# Altium project Autonomous Terminal Board.PrjPcb
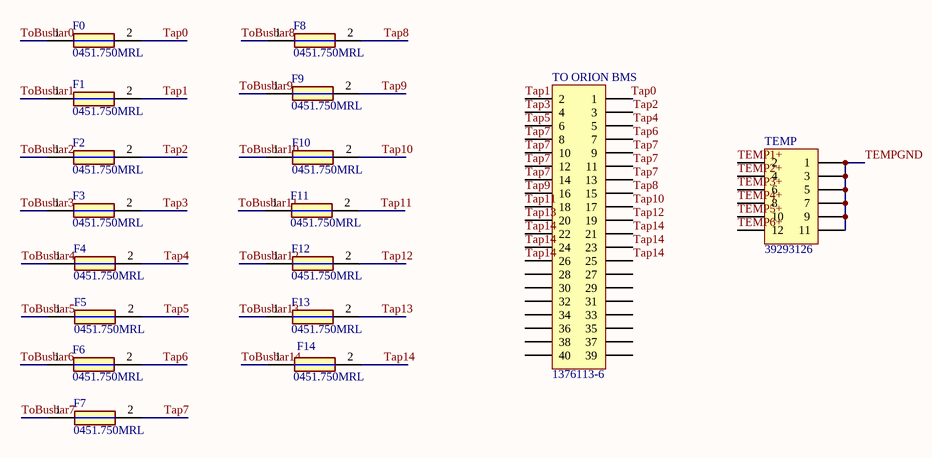
[diagram p0: Terminal Board Schematic.SchDoc]
1 sheet, 17 parts. Net scope: global (net labels, ports and power ports of the same name join across sheets).
Board files: Terminal_Board_PCB.PcbDoc, Terminal_Board_PCB V2.PcbDoc, Terminal_Board_PCB V3.PcbDoc, Terminal_Board_PCB V4.PcbDoc

## Sheet Terminal Board Schematic.SchDoc
size A3; SheetNumber: 1; SheetTotal: 1

### Parts
F0  0451.750MRL  [FUSC6127X269N]
F1  0451.750MRL  [FUSC6127X269N]
F2  0451.750MRL  [FUSC6127X269N]
F3  0451.750MRL  [FUSC6127X269N]
F4  0451.750MRL  [FUSC6127X269N]
F5  0451.750MRL  [FUSC6127X269N]
F6  0451.750MRL  [FUSC6127X269N]
F7  0451.750MRL  [FUSC6127X269N]
F8  0451.750MRL  [FUSC6127X269N]
F9  0451.750MRL  [FUSC6127X269N]
F10  0451.750MRL  [FUSC6127X269N]
F11  0451.750MRL  [FUSC6127X269N]
F12  0451.750MRL  [FUSC6127X269N]
F13  0451.750MRL  [FUSC6127X269N]
F14  0451.750MRL  [FUSC6127X269N]
TEMP  39293126  [39293126]
TO_ORION_BMS  1376113-6  [1376113-6]

### Nets
Tap0: F0.2 TO_ORION_BMS.1
Tap1: F1.2 TO_ORION_BMS.2
Tap2: F2.2 TO_ORION_BMS.3
Tap3: F3.2 TO_ORION_BMS.4
Tap4: F4.2 TO_ORION_BMS.5
Tap5: F5.2 TO_ORION_BMS.6
Tap6: F6.2 TO_ORION_BMS.7
Tap7: F7.2 TO_ORION_BMS.8 TO_ORION_BMS.9 TO_ORION_BMS.10 TO_ORION_BMS.11 TO_ORION_BMS.12 TO_ORION_BMS.13 TO_ORION_BMS.14
Tap8: F8.2 TO_ORION_BMS.15
Tap9: F9.2 TO_ORION_BMS.16
Tap10: F10.2 TO_ORION_BMS.17
Tap11: F11.2 TO_ORION_BMS.18
Tap12: F12.2 TO_ORION_BMS.19
Tap13: F13.2 TO_ORION_BMS.20
Tap14: F14.2 TO_ORION_BMS.21 TO_ORION_BMS.22 TO_ORION_BMS.23 TO_ORION_BMS.24 TO_ORION_BMS.25 TO_ORION_BMS.26
TEMP1+: TEMP.2
TEMP2+: TEMP.4
TEMP3+: TEMP.6
TEMP4+: TEMP.8
TEMP5+: TEMP.10
TEMP6+: TEMP.12
TEMPGND: TEMP.1 TEMP.3 TEMP.5 TEMP.7 TEMP.9 TEMP.11
ToBusbar0: F0.1
ToBusbar1: F1.1
ToBusbar2: F2.1
ToBusbar3: F3.1
ToBusbar4: F4.1
ToBusbar5: F5.1
ToBusbar6: F6.1
ToBusbar7: F7.1
ToBusbar8: F8.1
ToBusbar9: F9.1
ToBusbar10: F10.1
ToBusbar11: F11.1
ToBusbar12: F12.1
ToBusbar13: F13.1
ToBusbar14: F14.1

Not connected (* = marked no-connect by the designer): TO_ORION_BMS 27 28 29 30 31 32 33 34 35 36 37 38 39 40

### Notes on the sheet
- Section Leader Check:
- Date:
- Title:
- Revision
- Variant
- Project:
- Engineers:
- Sheet
- of

### Library data of the parts
F0-F14 = 0451.750MRL: Fuse Chip Very Fast Acting 0.75A 125V SMD Solder Pad 2410 Ceramic T/R; Manufacturer_Name: LITTELFUSE; Current Rating: 750mA; Resistance: 245mR; Fuse Type: Board Mount (Cartridge Style Excluded); Approvals: UL,CSA; Datasheet Link: http://www.farnell.com/datasheets/88908.pdf; Height: 2.69mm; Manufacturer_Part_Number: 0451.750MRL; Arrow Part Number: 0451.750MRL; Arrow Price/Stock: https://www.arrow.com/en/products/0451.750mrl/littelfuse; Supplier 1: Digi-Key; Supplier Part Number 1: F2576CT-ND; Manufacturer: Littelfuse; Manufacturer Part Number: 0451.750MRL; RoHS: Yes; Category: Fuses; Stock 1: 2247; Pricing 1: 1=1.52000, 5=1.46800, 10=1.37400, 50=1.13720, 100=0.94770, 250=0.92404, 500=0.78188 (USD); Mount: Surface Mount; Case/Package: SMD/SMT; Number of Pins: 2; Body Material: Ceramic; Contact Plating: Silver; Housing Material: Ceramic; Min Operating Temperature: -55°C; Max Operating Temperature: 125°C; Package Quantity: 1000; Voltage Rating (AC): 125V; Voltage Rating (DC): 125V; Packaging: Tape and Reel; Voltage Rating: 125V; DC Cold Resistance: 245mR; Termination: SMD/SMT; Fuse Current: 750mA; Working Voltage: 125V; Series: 451; Diameter: 2.69mm; Length: 6.1mm; Width: 0.106inch; Depth: 2.69mm; Size: 2.69mm; Radiation Hardening: No; REACH SVHC: Unknown; Lead Free: Lead Free; RoHS Compliant: Yes; ComponentLink1URL: https://datasheet.ciiva.com/299/littelfuse-fuse-451-453-299680.pdf?src-supplier=Digi-Key; ComponentLink1Description: https://datasheet.ciiva.com/299/littelfuse-fuse-451-453-299680.pdf?src-supplier=Digi-Key; ComponentLink2URL: https://datasheet.ciiva.com/299/littelfuse-fuse-451-453-299681.pdf?src-supplier=Digi-Key; ComponentLink2Description: https://datasheet.ciiva.com/299/littelfuse-fuse-451-453-299681.pdf?src-supplier=Digi-Key; ComponentLink3URL: https://datasheet.ciiva.com/299/littelfuse-fuse-451-453-299682.pdf?src-supplier=Digi-Key; ComponentLink3Description: https://datasheet.ciiva.com/299/littelfuse-fuse-451-453-299682.pdf?src-supplier=Digi-Key; ComponentLink4URL: https://datasheet.ciiva.com/1549/48276-1549572.pdf?src-supplier=Element14; ComponentLink4Description: https://datasheet.ciiva.com/1549/48276-1549572.pdf?src-supplier=Element14; ComponentLink5URL: https://datasheet.ciiva.com/22713/48276-22713020.pdf?src-supplier=Element14; ComponentLink5Description: https://datasheet.ciiva.com/22713/48276-22713020.pdf?src-supplier=Element14; ComponentLink6URL: https://datasheet.ciiva.com/16300/451-453-16300317.pdf?src-supplier=Future+Electronics; ComponentLink6Description: https://datasheet.ciiva.com/16300/451-453-16300317.pdf?src-supplier=Future+Electronics; ComponentLink7URL: https://datasheet.ciiva.com/15187/getdatasheetpartid-92973-15187046.pdf?src-supplier=Verical; ComponentLink7Description: https://datasheet.ciiva.com/15187/getdatasheetpartid-92973-15187046.pdf?src-supplier=Verical
TEMP = 39293126: PLUG & SOCKET CONNECTOR, HEADER, 12 POSITION, 4.2MM; Product Range:Mini-Fit Jr Series; Contact Termination Type:Through Hole; Gender:Receptacle; No. of Contacts:12; Pitch Spacing:4.2mm; Contact Plating:Tin Plated Contacts ;RoHS Compliant: Yes; Manufacturer: Molex; Row Spacing: 5.5mm; Angle: 0; Flange: No; Contact: Tin; Current Rating: 9A; Voltage Rating: 600V; Max Voltage Rating (DC): 600.6kV; Contact Resistance: 10mR; Max Current Rating: 6A; Gender: Female; Number of Ports: 1; Contact Post Length: 3.5mm; Glow Wire Compliant: Non-compliant; Part Number: 39293126; Positions: 12; Pitch: 4.2mm; Digikey Part Number: WM3848-ND; Supplier 1: Newark; Supplier Part Number 1: 01AH8322; Manufacturer Part Number: 39-29-3126; RoHS: Yes; Category: Headers and Wire Housings; Stock 1: 403; Pricing 1: 1=0.99300, 10=0.99300, 25=0.99300, 50=0.99300, 100=0.91100, 250=0.91100 (USD); Mount: Through Hole; Contact Material: Brass; Contact Plating: Tin,Copper; Housing Color: Natural; Color: Natural; Housing Material: Nylon; Min Operating Temperature: -40°C; Max Operating Temperature: 105°C; Termination: Solder; Orientation: Straight; Package Quantity: 225; Number of Rows: 2; Packaging: Bulk; Contact Gender: Male; Number of Positions: 12; Number of Contacts: 12; Number of Circuits: 12; Fastening Type: Ramp; Series: Mini-Fit® Jr™ 5566; Contact Type: Male Pin; Max Voltage Rating (AC): 600V; Height: 12.8mm; Depth: 11mm; Radiation Hardening: No; Halogen Free: Low Halogen; RoHS Compliant: Yes; ComponentLink1URL: https://datasheet.ciiva.com/19461/1299462-19461278.pdf?src-supplier=Jameco; ComponentLink1Description: https://datasheet.ciiva.com/19461/1299462-19461278.pdf?src-supplier=Jameco; ComponentLink2URL: https://datasheet.ciiva.com/5150/0039293126-pcb-headers-140105-5150183.pdf?src-supplier=Mouser; ComponentLink2Description: https://datasheet.ciiva.com/5150/0039293126-pcb-headers-140105-5150183.pdf?src-supplier=Mouser; ComponentLink3URL: https://datasheet.ciiva.com/16654/0039293126-pcb-headers-16654565.pdf?src-supplier=Avnet+Europe; ComponentLink3Description: https://datasheet.ciiva.com/16654/0039293126-pcb-headers-16654565.pdf?src-supplier=Avnet+Europe; ComponentLink4URL: https://datasheet.ciiva.com/30119/70260039293126-pcb-headers-30119121.pdf?src-supplier=Onlinecomponents.com; ComponentLink4Description: https://datasheet.ciiva.com/30119/70260039293126-pcb-headers-30119121.pdf?src-supplier=Onlinecomponents.com; ComponentLink5URL: https://datasheet.ciiva.com/1403/1596536-1403542.pdf?src-supplier=Element14; ComponentLink5Description: https://datasheet.ciiva.com/1403/1596536-1403542.pdf?src-supplier=Element14
TO_ORION_BMS = 1376113-6: ORION BMS 40 Pin Header; Positions: 40; Pitch: 3; Row Spacing: 2.2; Angle: 180; Flange: na; Contact: Gold; Part Number: 1376113-6; Digikey Part Number: 1376113-6-ND; Digikey Link: https://www.digikey.com.au/products/en?keywords=1376113-6; Supplier 1: Digi-Key; Supplier Part Number 1: A121638-ND